# EAGLE design MikrofonZeWzmacniaczemSchematNowy2 (EAGLE 7.3.0)
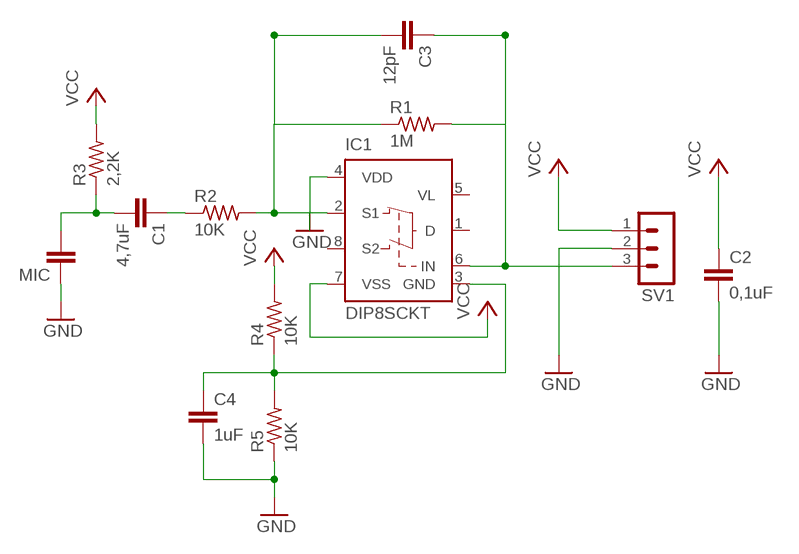
[diagram p0: schematic, sheet 1]

## Parts
C1  4,7uF  C-EUC0805  [C0805]
C2  0,1uF  C-EUC0805  [C0805]
C3  12pF  C-EUC0805  [C0805]
C4  1uF  C-EUC0805  [C0805]
IC1  DIP8SCKT  ADG419  [DIL08]
MIC  C2.5/6  [C2.5-6]
R1  1M  R-US_R0805  [R0805]
R2  10K  R-US_R0805  [R0805]
R3  2,2K  R-US_R0805  [R0805]
R4  10K  R-US_R0805  [R0805]
R5  10K  R-US_R0805  [R0805]
SV1  MA03-1  [MA03-1]

## Nets
GND: C2.2 C4.2 IC1.4(VDD) MIC.1 R5.1 SV1.2
N$1: C3.2 IC1.2(S1) R1.1 R2.2
N$2: C3.1 IC1.6(IN) R1.2 SV1.3
N$3: C4.1 IC1.3(GND) R4.1 R5.2
N$6: C1.1 R2.1
N$7: C1.2 MIC.2 R3.1
VCC: C2.1 IC1.7(VSS) R3.2 R4.2 SV1.1
Unconnected: IC1.1(D) IC1.8(S2)

## Power pins joined to a net without a drawn wire
VL: IC1.5(VL)

## Library data of the parts
C1-C4 = rcl:C-EU: CAPACITOR, European symbol
IC1 = analog-devices:ADG419: LC²MOS Precision Mini-DIP Analog switch Source: http://www.analog.com/UploadedFiles/Data_Sheets/ADG419.pdf; MF: ALTERA CORPORATION; MPN: DIP8SOCKET; OC_FARNELL: 1438705; OC_NEWARK: 16F6524
MIC = capacitor-wima:C: CAPACITOR naming: grid - package width
R1-R5 = resistor:R-US_: RESISTOR, American symbol
SV1 = con-lstb:MA03-1: PIN HEADER; OC_FARNELL: unknown; OC_NEWARK: unknown

## Board
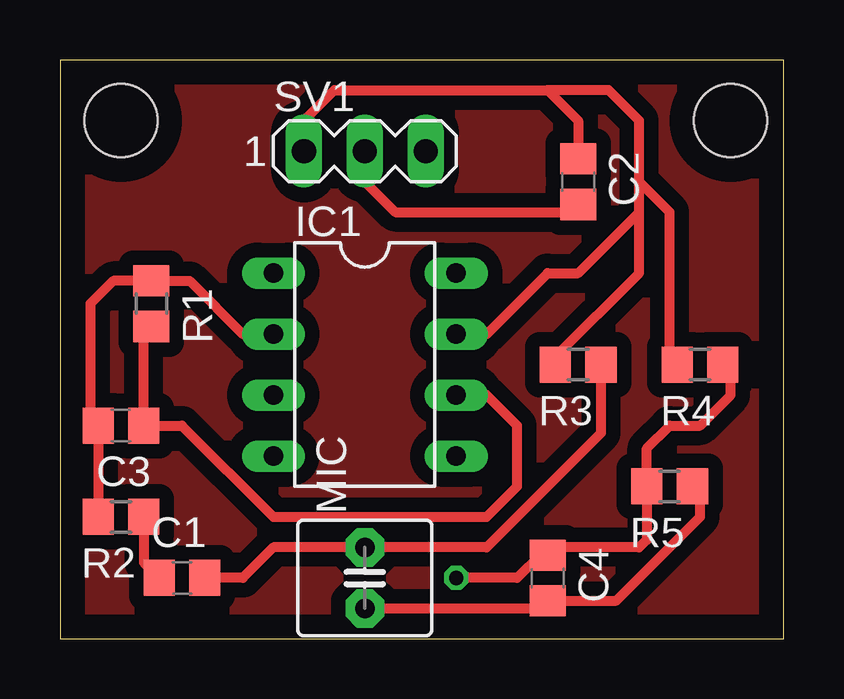
[diagram p1: board, top side]
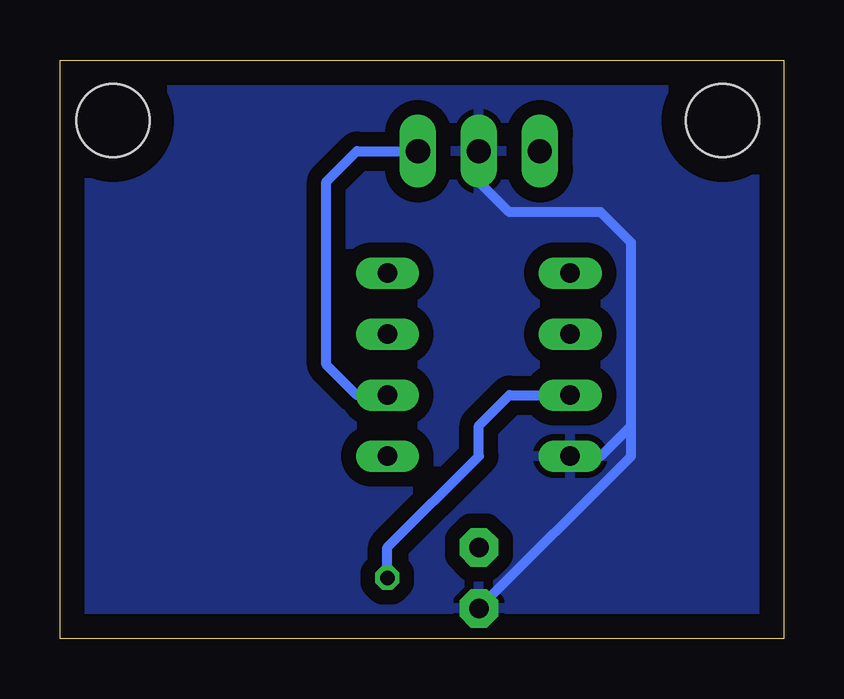
[diagram p2: board, bottom side, seen from below]

Size 30.15 x 24.12 mm. Coordinates in mm from the lower left corner, seen from the top.
Outline: 0,0 30.15,0 30.15,24.12 0,24.12 0,0
Copper layers (1*16): Top 0.035mm / dielectric 1.5mm / Bottom 0.035mm
Design rules "default": minimum track width 10mil, minimum drill 24mil, track to track 8mil, track to pad 8mil, pad to pad 8mil, via to via 8mil, smd to smd 8mil, copper to edge 40mil, drill to drill 8mil, minimum pad ring 10mil, minimum via ring 8mil, stop-mask expansion 4mil, vias tented up to drill 0mil, thermal gap 10mil
Holes 3.05 mm at 2.54,21.59 27.94,21.59

### Footprints (pad centres in the part's own frame; a part is rotated, then mirrored left to right if it is on the bottom)
C0805 = smd 1.3 x 1.5: 1 -0.95,0; 2 0.95,0
DIL08 = drill 0.813 long: 1 -3.81,-3.81; 2 -1.27,-3.81; 3 1.27,-3.81; 4 3.81,-3.81; 5 3.81,3.81; 6 1.27,3.81; 7 -1.27,3.81; 8 -3.81,3.81
C2.5-6 = drill 0.813 pad 1.6 octagon: 1 -1.27,0; 2 1.27,0
R0805 = smd 1.3 x 1.5: 1 -0.95,0; 2 0.95,0
MA03-1 = drill 1.016 long: 1 -2.54,0; 2 0,0; 3 2.54,0

### Placement (x,y rotation side)
C1  5.08,2.54 0 top
C2  21.59,19.05 270 top
C3  2.54,8.89 180 top
C4  20.32,2.54 270 top
IC1  12.7,11.43 270 top
MIC  12.7,2.54 90 top
R1  3.81,13.97 270 top
R2  2.54,5.08 180 top
R3  21.59,11.43 180 top
R4  26.67,11.43 180 top
R5  25.4,6.35 180 top
SV1  12.7,20.32 0 top

### Tracks (layer width: path | path; a pad name or v marks a point on that pad's centre or on a via)
GND
  Top 0.406: SV1.2 12.7,19.05 13.97,17.78 21.59,17.78 C2.2 | MIC.1 20,1.27 C4.2 23.18,1.59 26.67,5.08 26.67,6.03 R5.1
  Bottom 0.406: IC1.4 7.62,7.62 6.35,8.89 | 6.35,8.89 6.35,16.51 7.62,17.78 11.43,17.78 12.7,19.05 SV1.2 | MIC.1 6.35,7.62 6.35,8.89
  pour Bottom (isolate 0.61): 0,24.13 30.48,24.13 30.48,0 0,0
N$1
  Top 0.406: IC1.2 7.62,12.7 5.4,14.92 R1.1 2.22,14.92 1.27,13.97 1.27,9.21 C3.2 R2.2
N$2
  Top 0.406: IC1.6 17.78,10.16 19.05,8.89 19.05,6.35 17.78,5.08 8.89,5.08 5.08,8.89 C3.1 3.49,12.7 R1.2
  Bottom 0.406: IC1.6 17.78,10.16 19.05,11.43 19.05,19.05 17.78,20.32 SV1.3
N$3  (via drill 0.6)
  Top 0.406: v16.51,2.54 19.05,2.54 20,3.49 C4.1 20.64,3.81 24.13,3.81 24.45,4.13 R5.2 24.45,7.94 25.4,8.89 26.67,8.89 27.94,10.16 27.94,11.11 R4.1
  Bottom 0.406: v16.51,2.54 16.51,3.81 12.7,7.62 12.7,8.89 11.43,10.16 IC1.3
N$4
  pour Top (isolate 0.61): 0,24.13 30.48,24.13 30.48,0 0,0
N$6
  Top 0.406: R2.1 3.49,3.18 C1.1
N$7
  Top 0.406: R3.1 22.54,8.57 17.78,3.81 MIC.2 8.89,3.81 7.62,2.54 C1.2
VCC
  Top 0.406: SV1.1 10.16,21.59 11.43,22.86 20.32,22.86 | 20.32,22.86 21.59,21.59 C2.1 | IC1.7 17.78,12.7 20.32,15.24 21.59,15.24 24.13,17.78 | 24.13,17.78 24.13,19.05 | 20.32,22.86 22.86,22.86 24.13,21.59 24.13,19.05 | 24.13,17.78 24.13,15.24 20.64,11.75 R3.2 | R4.2 25.4,11.75 25.4,17.78 24.13,19.05